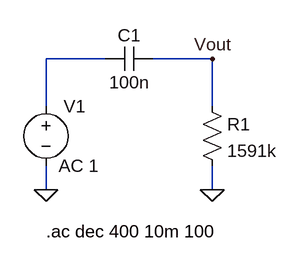
[diagram p0: schematic circuito2.asc]
circuito2.asc, the LTspice schematic file:
Version 4
SHEET 1 880 680
WIRE -32 -32 -112 -32
WIRE 112 -32 32 -32
WIRE -112 32 -112 -32
WIRE 112 32 112 -32
WIRE -112 144 -112 112
WIRE 112 144 112 112
FLAG -112 144 0
FLAG 112 144 0
FLAG 112 -32 Vout
SYMBOL voltage -112 16 R0
WINDOW 123 17 96 Left 2
WINDOW 39 0 0 Left 0
SYMATTR Value2 AC 1
SYMATTR InstName V1
SYMATTR Value ""
SYMBOL res 96 16 R0
SYMATTR InstName R1
SYMATTR Value 1591k
SYMBOL cap 32 -48 R90
WINDOW 0 0 32 VBottom 2
WINDOW 3 32 32 VTop 2
SYMATTR InstName C1
SYMATTR Value 100n
TEXT -112 200 Left 2 !.ac dec 400 10m 100

The netlist it stands for:
* circuito2.asc
V1 N001 0 AC 1
R1 Vout 0 1591k
C1 Vout N001 100n
.ac dec 400 10m 100
.backanno
.end

* Results of the author's LTspice run, read from the files saved beside the schematic
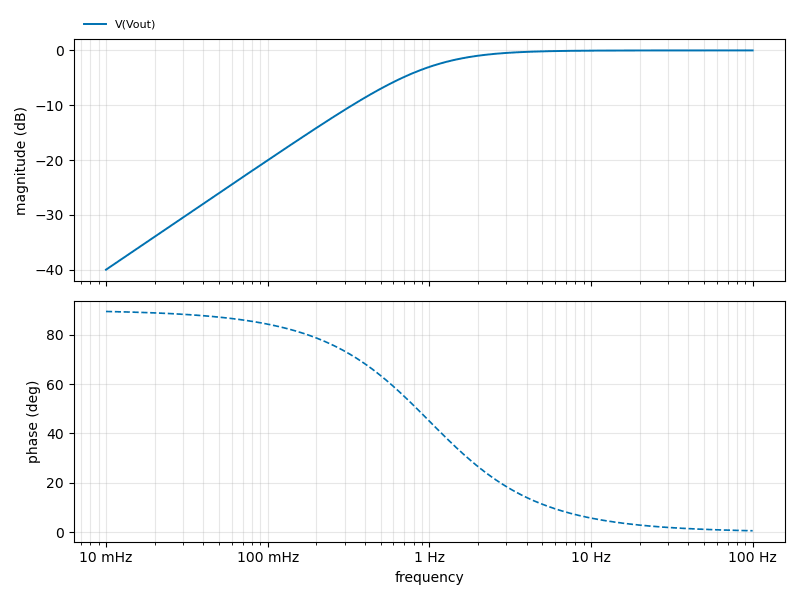
[diagram p1: AC Analysis of circuito2.asc, plotted from the saved traces]
* AC Analysis, 1 run:
*   V(Vout): -40.00 dB at 10 mHz, -0.00 dB at 100 Hz, peak -0.00 dB at 100 Hz, 3 dB below the peak at 1 Hz